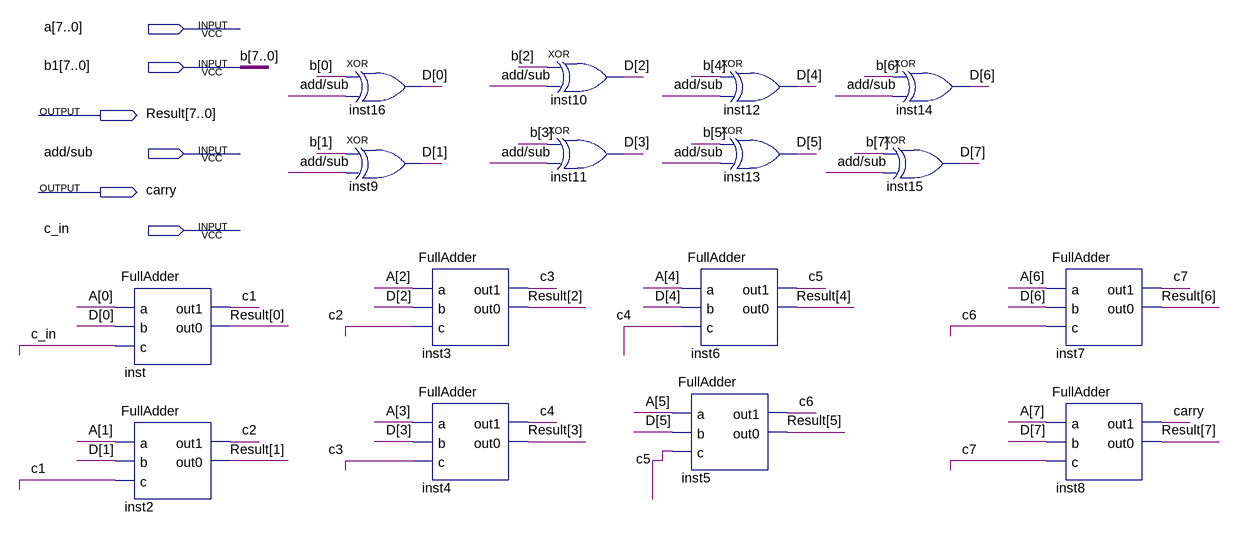
[diagram p0: schematic sheet]
// Quartus schematic Adder8.bdf as structural Verilog: 16 symbols, 6 pins
module Adder8 (
  input  [7:0] a,
  input  [7:0] b1,
  input  \add/sub ,
  input  c_in,
  output [7:0] Result,
  output carry
);

  wire c1, c2, c3, c4, c5, c6, c7;
  wire [7:0] D;

  FullAdder inst (.a(a[0]), .b(D[0]), .c(c_in), .out1(c1), .out0(Result[0]));
  FullAdder inst2 (.a(a[1]), .b(D[1]), .c(c1), .out1(c2), .out0(Result[1]));
  xor inst16 (D[0], b1[0], \add/sub );
  xor inst9 (D[1], b1[1], \add/sub );
  FullAdder inst3 (.a(a[2]), .b(D[2]), .c(c2), .out1(c3), .out0(Result[2]));
  FullAdder inst4 (.a(a[3]), .b(D[3]), .c(c3), .out1(c4), .out0(Result[3]));
  xor inst10 (D[2], b1[2], \add/sub );
  xor inst11 (D[3], b1[3], \add/sub );
  xor inst12 (D[4], b1[4], \add/sub );
  xor inst13 (D[5], b1[5], \add/sub );
  FullAdder inst6 (.a(a[4]), .b(D[4]), .c(c4), .out1(c5), .out0(Result[4]));
  FullAdder inst5 (.a(a[5]), .b(D[5]), .c(c5), .out1(c6), .out0(Result[5]));
  xor inst14 (D[6], b1[6], \add/sub );
  xor inst15 (D[7], b1[7], \add/sub );
  FullAdder inst7 (.a(a[6]), .b(D[6]), .c(c6), .out1(c7), .out0(Result[6]));
  FullAdder inst8 (.a(a[7]), .b(D[7]), .c(c7), .out1(carry), .out0(Result[7]));

  // Other names for the same wires on the sheet: b[7:0] = b1
endmodule
